# Altium schematic sheet Top.SchDoc: Top Level
size A3; CompanyName: NOT USED; DocumentNumber: 10; SheetNumber: 10; SheetTotal: 10; PageSetup: Record=PageOptions|CenterHorizontal=True|CenterVertical=True|PrintScale=1.00|XCorrection=1.00|YCorrection=1.00|PrintKind=0|BorderSize=5000000|LeftOffset=0|BottomOffset=0|Orientation=2|PaperLength=1000|PaperWidth=1000|Scale=100|PaperSource=7|PrintQuality=-4|MediaType=1|DitherType=10|PaperKind=A3|PrintScaleMode=0
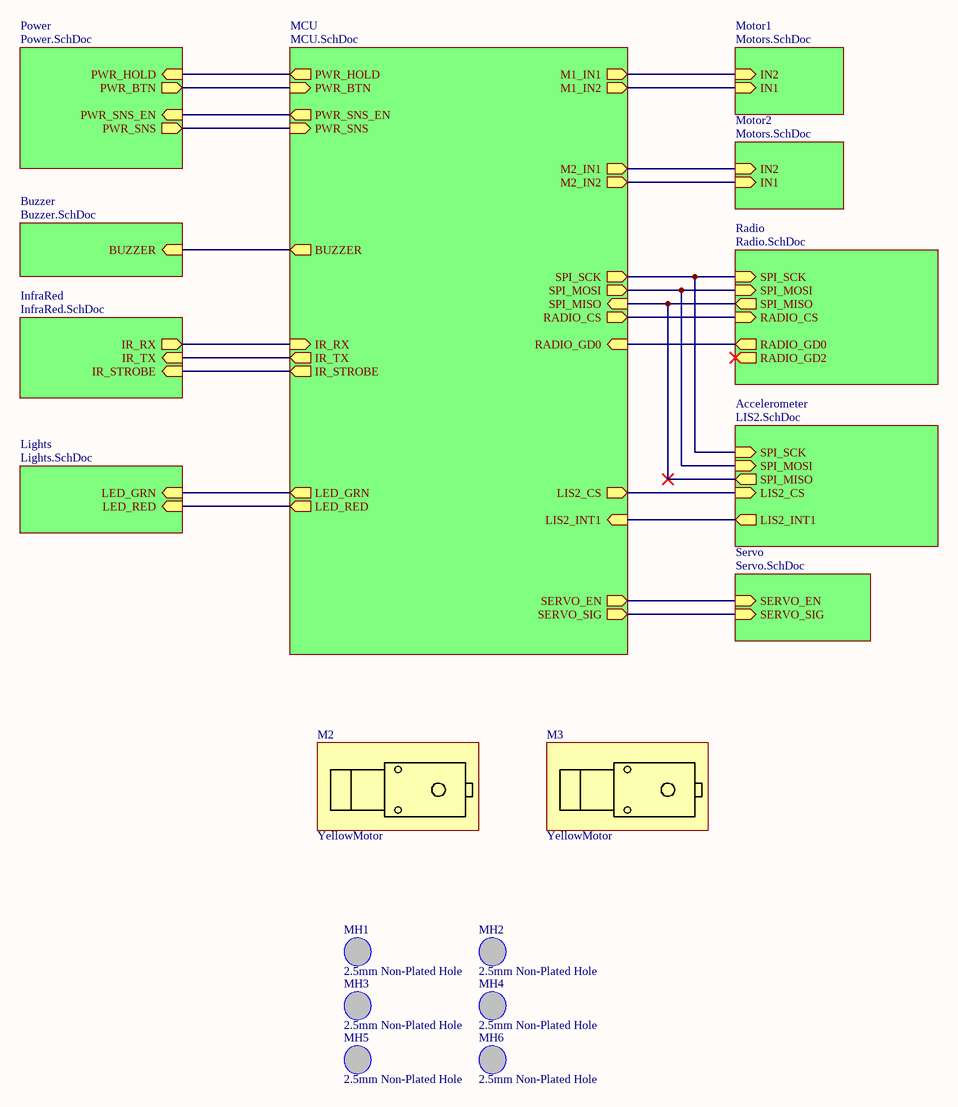
[diagram p0: Top.SchDoc]

## Parts
M2  YellowMotor  [YELLOW_MOTOR]
M3  YellowMotor  [YELLOW_MOTOR]
MH1  2.5mm Non-Plated Hole  [MTG250X550]  (no BOM)
MH2  2.5mm Non-Plated Hole  [MTG250X550]  (no BOM)
MH3  2.5mm Non-Plated Hole  [MTG250X550]  (no BOM)
MH4  2.5mm Non-Plated Hole  [MTG250X550]  (no BOM)
MH5  2.5mm Non-Plated Hole  [MTG250X550]  (no BOM)
MH6  2.5mm Non-Plated Hole  [MTG250X550]  (no BOM)

## Sub-sheets
Accelerometer = LIS2.SchDoc: SPI_MISO (out), LIS2_CS (in), LIS2_INT1 (out), SPI_SCK (in), SPI_MOSI (in)
Buzzer = Buzzer.SchDoc: BUZZER (in)
InfraRed = InfraRed.SchDoc: IR_RX (out), IR_TX (in), IR_STROBE (in)
Lights = Lights.SchDoc: LED_GRN (in), LED_RED (in)
MCU = MCU.SchDoc: RADIO_GD0 (in), M1_IN1 (out), IR_TX (out), PWR_BTN (in), M1_IN2 (out), LED_GRN (out), LED_RED (out), PWR_SNS_EN (out), PWR_SNS (in), IR_STROBE (out), BUZZER (out), M2_IN2 (out), RADIO_CS (out), IR_RX (in), PWR_HOLD (out), M2_IN1 (out), SERVO_SIG (out), SPI_SCK (out), SERVO_EN (out), SPI_MISO (in), SPI_MOSI (out), LIS2_CS (out), LIS2_INT1 (in)
Motor1 = Motors.SchDoc: IN2 (in), IN1 (in)
Motor2 = Motors.SchDoc: IN2 (in), IN1 (in)
Power = Power.SchDoc: PWR_HOLD (in), PWR_SNS_EN (in), PWR_BTN (out), PWR_SNS (out)
Radio = Radio.SchDoc: RADIO_CS (in), RADIO_GD0 (out), RADIO_GD2 (out), SPI_SCK (in), SPI_MISO (out), SPI_MOSI (in)
Servo = Servo.SchDoc: SERVO_SIG (in), SERVO_EN (in)

## Nets
(unnamed): sheet Motor1/IN2, sheet MCU/M1_IN1
(unnamed): sheet Motor1/IN1, sheet MCU/M1_IN2
(unnamed): sheet Motor2/IN2, sheet MCU/M2_IN1
(unnamed): sheet Motor2/IN1, sheet MCU/M2_IN2
(unnamed): sheet Radio/RADIO_CS, sheet MCU/RADIO_CS
(unnamed): sheet Radio/RADIO_GD0, sheet MCU/RADIO_GD0
(unnamed): sheet Radio/SPI_SCK, sheet MCU/SPI_SCK, sheet Accelerometer/SPI_SCK
(unnamed): sheet Radio/SPI_MISO, sheet MCU/SPI_MISO, sheet Accelerometer/SPI_MISO
(unnamed): sheet Radio/SPI_MOSI, sheet MCU/SPI_MOSI, sheet Accelerometer/SPI_MOSI
(unnamed): sheet Power/PWR_HOLD, sheet MCU/PWR_HOLD
(unnamed): sheet Power/PWR_SNS_EN, sheet MCU/PWR_SNS_EN
(unnamed): sheet Power/PWR_BTN, sheet MCU/PWR_BTN
(unnamed): sheet Power/PWR_SNS, sheet MCU/PWR_SNS
(unnamed): sheet MCU/IR_TX, sheet InfraRed/IR_TX
(unnamed): sheet MCU/LED_GRN, sheet Lights/LED_GRN
(unnamed): sheet MCU/LED_RED, sheet Lights/LED_RED
(unnamed): sheet MCU/IR_STROBE, sheet InfraRed/IR_STROBE
(unnamed): sheet MCU/BUZZER, sheet Buzzer/BUZZER
(unnamed): sheet MCU/IR_RX, sheet InfraRed/IR_RX
(unnamed): sheet MCU/SERVO_SIG, sheet Servo/SERVO_SIG
(unnamed): sheet MCU/SERVO_EN, sheet Servo/SERVO_EN
(unnamed): sheet MCU/LIS2_CS, sheet Accelerometer/LIS2_CS
(unnamed): sheet MCU/LIS2_INT1, sheet Accelerometer/LIS2_INT1

## Notes on the sheet
- Project
- Size:
- Date:
- A3
- Revision:
- Sheet
- of
- Lambo
- File:

## Library data of the parts
MH1-MH6 = NONPART-007: Display_Name: 2.5mm Non-Plated Hole; BWA PN: NONPART-007; Schematic Symbol: HOLE_UNPLATED